# EAGLE design Keypad_Shield (EAGLE 6.4)
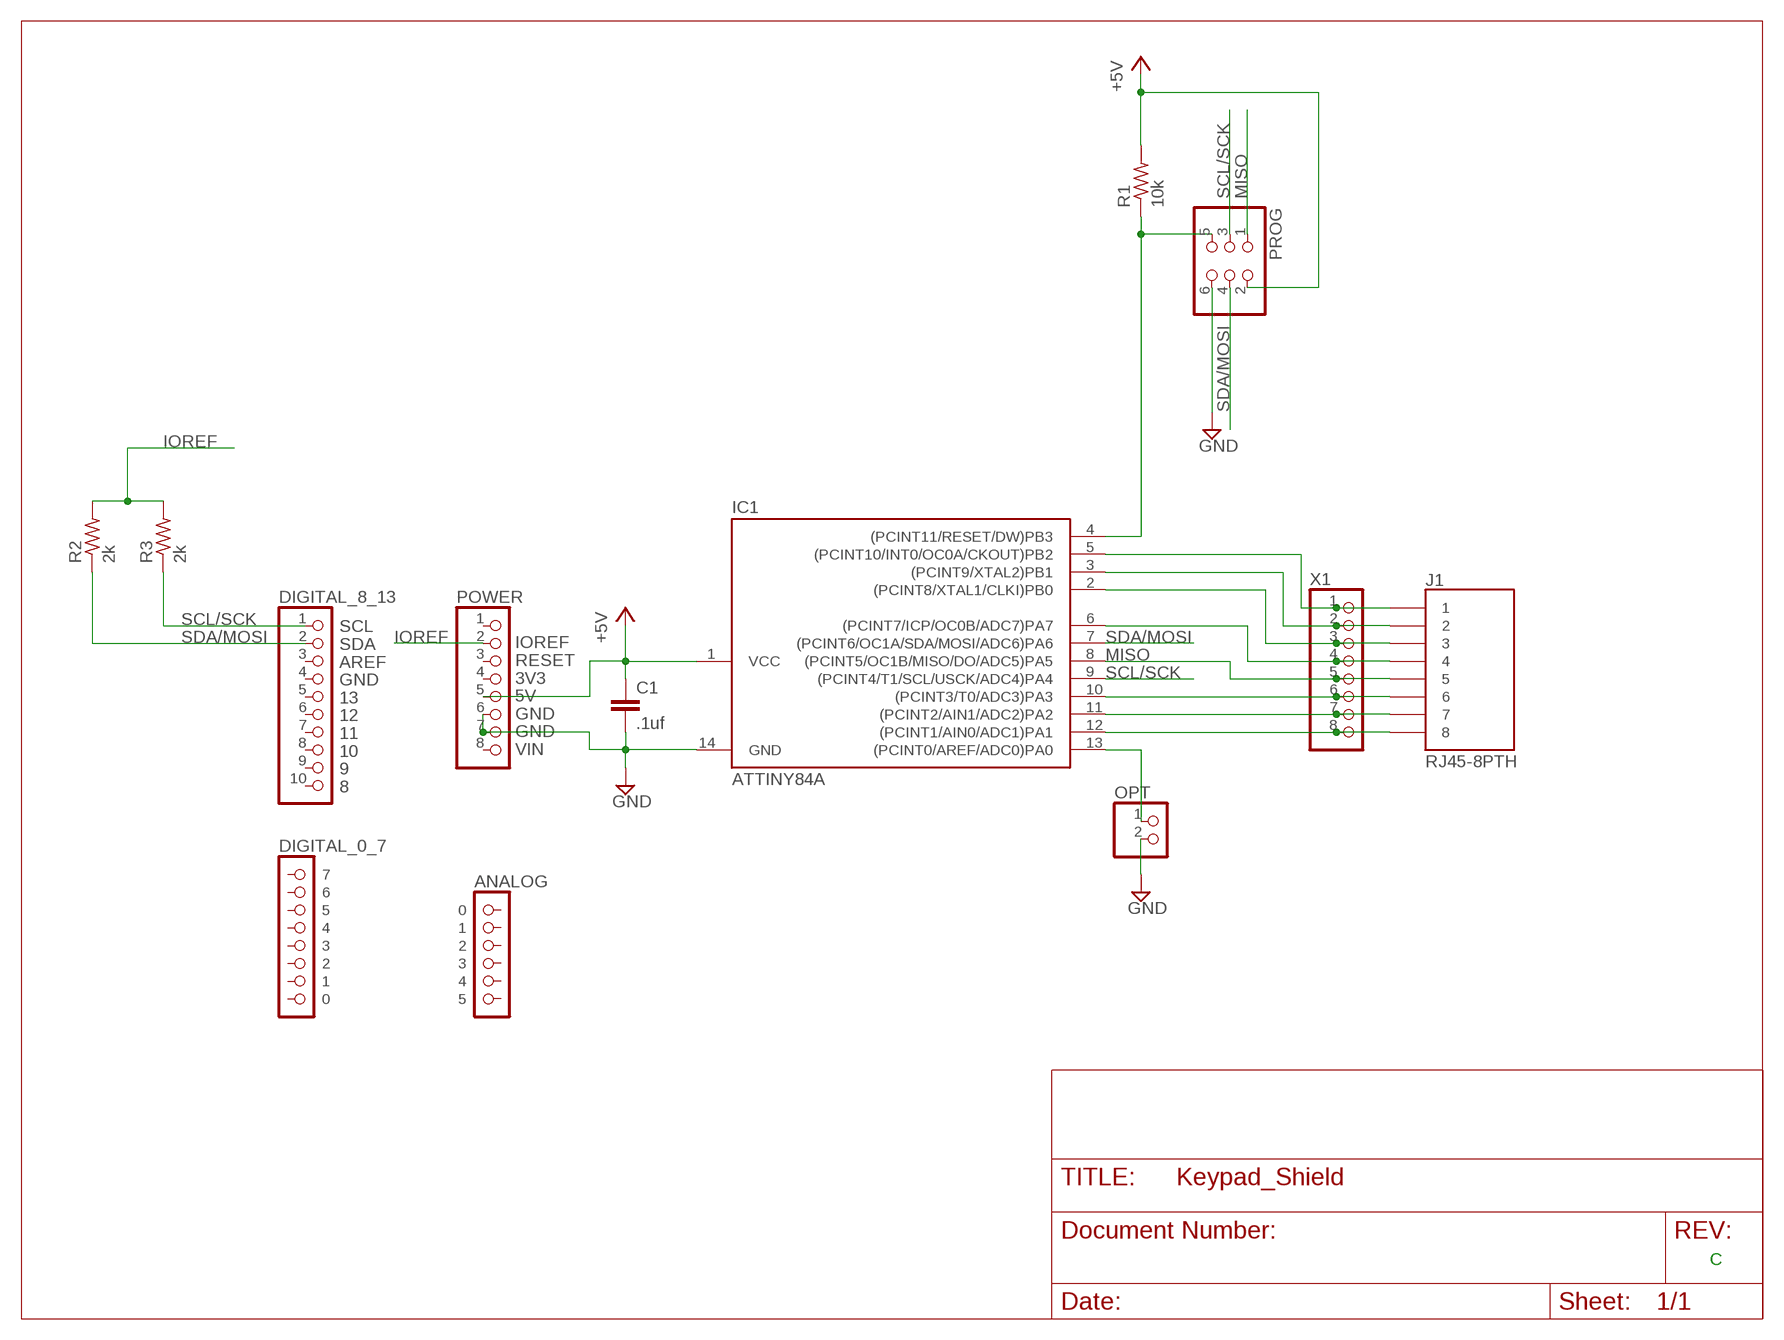
[diagram p0: schematic, sheet 1]

## Parts
C1  .1uf  C5/5  [C5B5]
DIGITAL_8_13  PINHD-1X10  [1X10]
IC1  ATTINY84A  TINY24/44/84-PU  [DIL14]
J1  RJ45-8PTH  [RJ45-8]
OPT  PINHD-1X2  [1X02]
POWER  PINHD-1X8  [1X08]
PROG  PINHD-2X3  [2X03]
R1  10k  R-US_0204/5  [0204/5]
R2  2k  R-US_0204/5  [0204/5]
R3  2k  R-US_0204/5  [0204/5]
U$2  ANALOG  [1X06]
U$3  DIGITAL_0_7  [1X08]
X1  HEADER-1X8ROUND  [1X08_ROUND]

## Nets
+5V: C1.1 IC1.1(VCC) POWER.5 PROG.2 R1.2
GND: C1.2 IC1.14(GND) OPT.2 POWER.6 POWER.7 PROG.6
IOREF: POWER.2 R2.2 R3.2
MISO: IC1.8((PCINT5/OC1B/MISO/DO/ADC5)PA5) J1.5 PROG.1 X1.5
N$1: IC1.4((PCINT11/RESET/DW)PB3) PROG.5 R1.1
N$2: IC1.13((PCINT0/AREF/ADC0)PA0) OPT.1
N$3: IC1.5((PCINT10/INT0/OC0A/CKOUT)PB2) J1.1 X1.1
N$4: IC1.3((PCINT9/XTAL2)PB1) J1.2 X1.2
N$5: IC1.2((PCINT8/XTAL1/CLKI)PB0) J1.3 X1.3
N$6: IC1.6((PCINT7/ICP/OC0B/ADC7)PA7) J1.4 X1.4
N$8: IC1.10((PCINT3/T0/ADC3)PA3) J1.6 X1.6
N$9: IC1.11((PCINT2/AIN1/ADC2)PA2) J1.7 X1.7
N$10: IC1.12((PCINT1/AIN0/ADC1)PA1) J1.8 X1.8
SCL/SCK: DIGITAL_8_13.1 IC1.9((PCINT4/T1/SCL/USCK/ADC4)PA4) PROG.3 R3.1
SDA/MOSI: DIGITAL_8_13.2 IC1.7((PCINT6/OC1A/SDA/MOSI/ADC6)PA6) PROG.4 R2.1
Unconnected: DIGITAL_8_13.3 DIGITAL_8_13.4 DIGITAL_8_13.5 DIGITAL_8_13.6 DIGITAL_8_13.7 DIGITAL_8_13.8 DIGITAL_8_13.9 DIGITAL_8_13.10 POWER.1 POWER.3 POWER.4 POWER.8 U$2.1 U$2.2 U$2.3 U$2.4 U$2.5 U$2.6 U$3.1 U$3.2 U$3.3 U$3.4 U$3.5 U$3.6 U$3.7 U$3.8

## Notes on the sheet
- IOREF
  RESET
  3V3
  5V
  GND
  GND
  VIN
- SCL
  SDA
  AREF
  GND
  13
  12
  11
  10
  9
  8
- C

## Library data of the parts
C1 = capacitor-wima:C: CAPACITOR naming: grid - package width
DIGITAL_8_13 = pinhead:PINHD-1X10: PIN HEADER
IC1 = avr-4:TINY24/44/84
J1 = SparkFun:RJ45-8: RJ45 Jack Simple RJ45, 8-pin connection - connector for common Cat5, Cat5e, and Cat6 Ethernet cables. Footprint not yet proven in production. Connector sku is PRT-00643; Breakout PCB sku is BOB-00716.
OPT = pinhead:PINHD-1X2: PIN HEADER
POWER = pinhead:PINHD-1X8: PIN HEADER
PROG = pinhead:PINHD-2X3: PIN HEADER
R1-R3 = rcl:R-US_: RESISTOR, American symbol
U$2 = arduino:ANALOG
U$3 = arduino:DIGITAL_0_7
X1 = microbuilder:HEADER-1X8: PIN HEADER

## Board
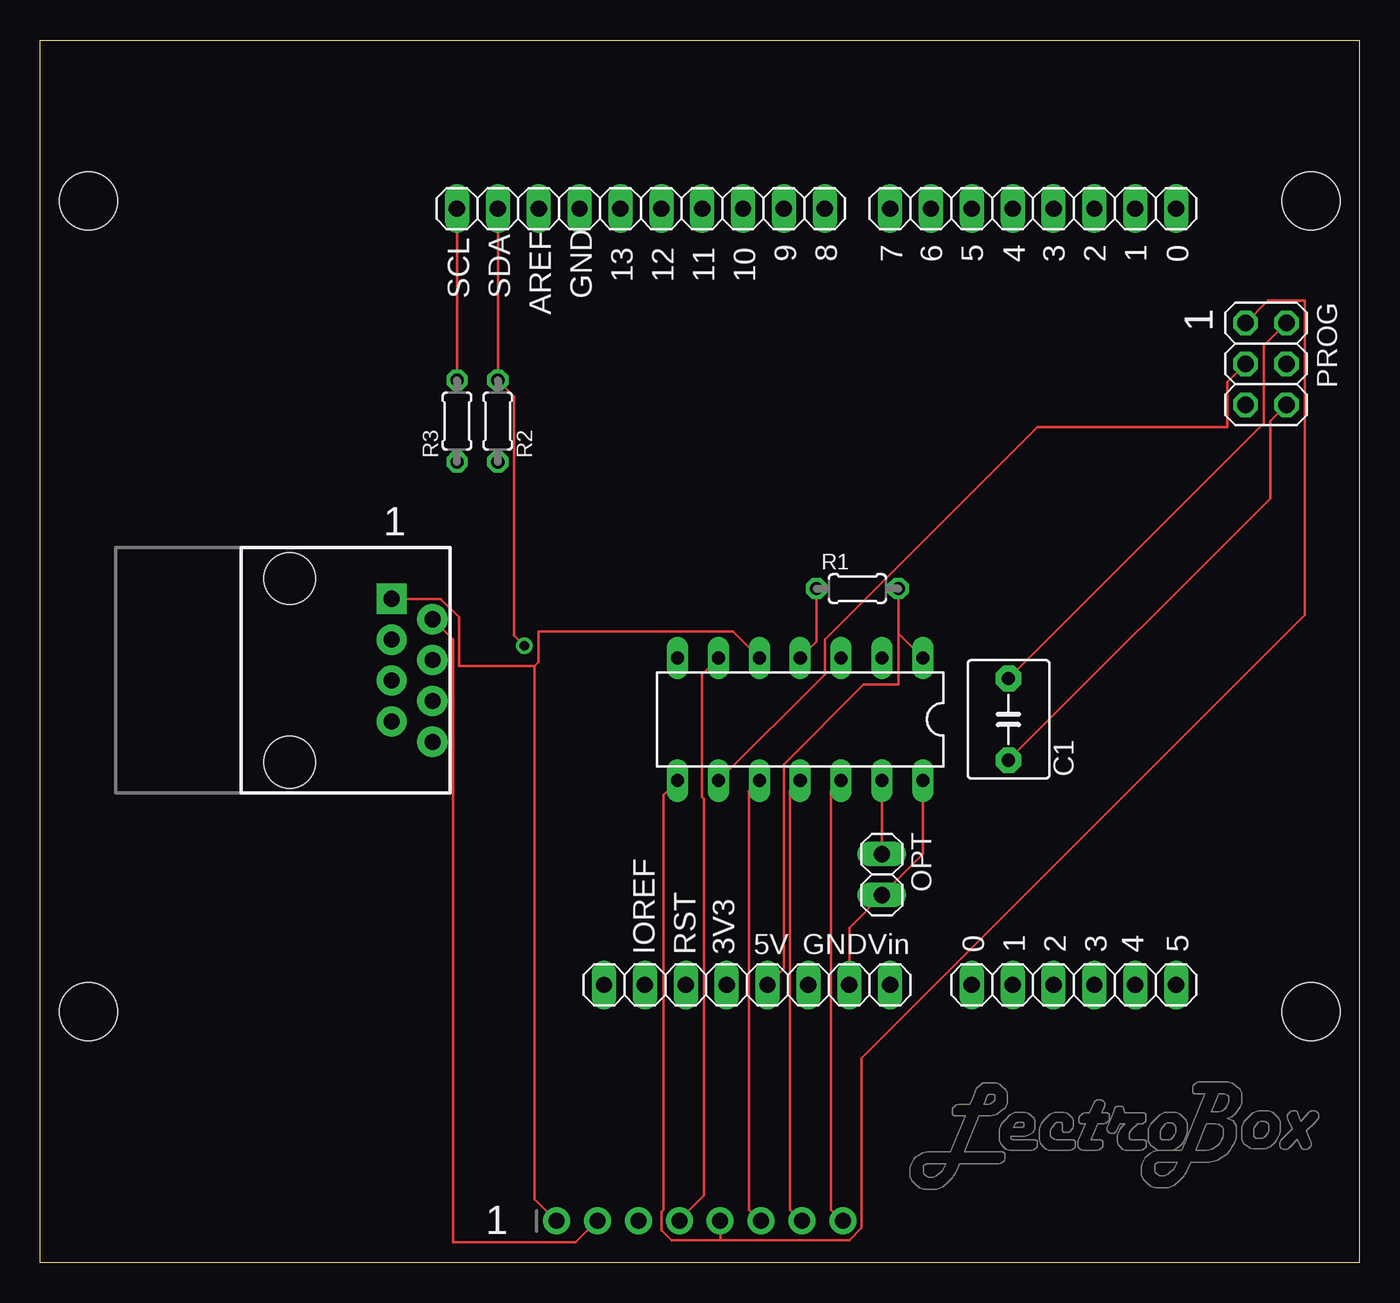
[diagram p1: board, top side]
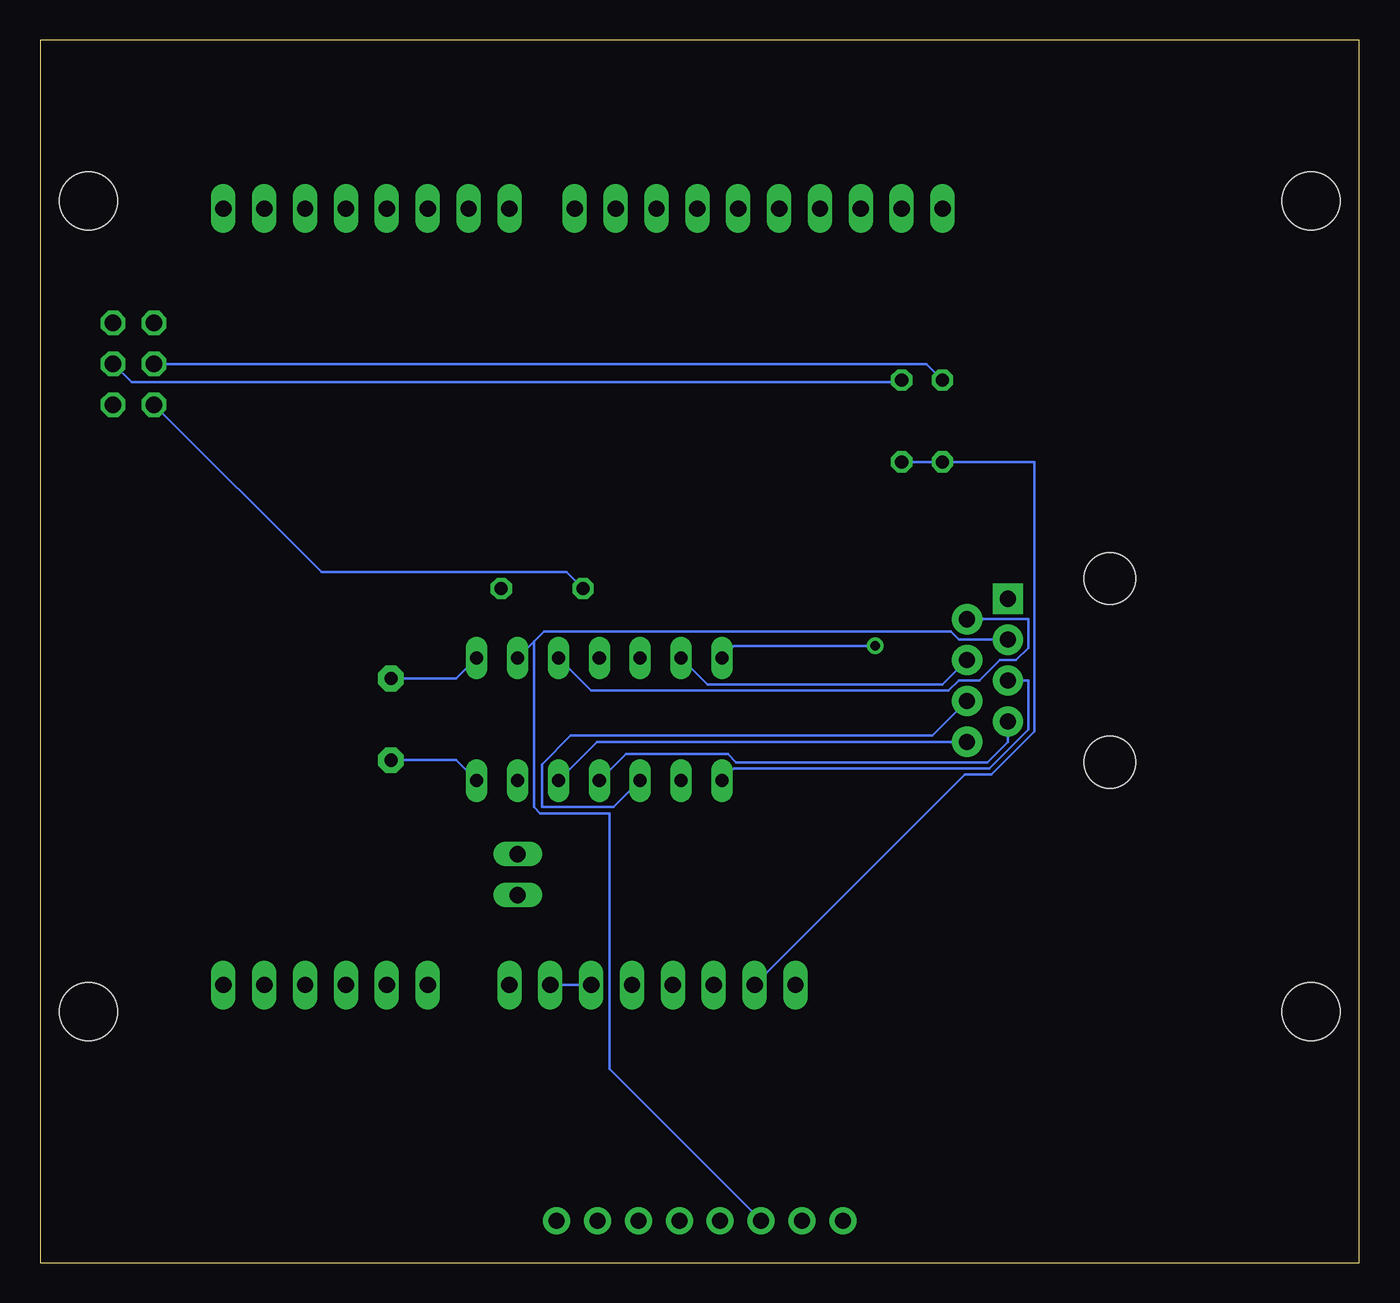
[diagram p2: board, bottom side, seen from below]

Size 82 x 76 mm. Coordinates in mm from the lower left corner, seen from the top.
Outline: 82,0 0,0 0,76 82,76 82,0
Copper layers (1*16): Top 0.035mm / dielectric 1.5mm / Bottom 0.035mm
Design rules "default *": minimum track width 6mil, minimum drill 24mil, track to track 8mil, track to pad 8mil, pad to pad 8mil, via to via 8mil, smd to smd 8mil, copper to edge 40mil, drill to drill 8mil, minimum pad ring 10mil, minimum via ring 8mil, stop-mask expansion 4mil, vias tented up to drill 0mil, thermal gap 10mil
Holes 3.6 mm at 3,66 79,66 3,15.6 79,15.6
tRestrict: area 32.8,52.1 to 68.6,55.9

### Footprints (pad centres in the part's own frame; a part is rotated, then mirrored left to right if it is on the bottom)
C5B5 = drill 0.813 pad 1.6 octagon: 1 -2.54,0; 2 2.54,0
1X10 = drill 1.016 long: 1 -11.43,0; 2 -8.89,0; 3 -6.35,0; 4 -3.81,0; 5 -1.27,0; 6 1.27,0; 7 3.81,0; 8 6.35,0; 9 8.89,0; 10 11.43,0
DIL14 = drill 0.813 long: 1 -7.62,-3.81; 2 -5.08,-3.81; 3 -2.54,-3.81; 4 0,-3.81; 5 2.54,-3.81; 6 5.08,-3.81; 7 7.62,-3.81; 8 7.62,3.81; 9 5.08,3.81; 10 2.54,3.81; 11 0,3.81; 12 -2.54,3.81; 13 -5.08,3.81; 14 -7.62,3.81
RJ45-8 = drill 1 pad 1.88 square: 1 -4.445,6.35 | drill 1 pad 1.88: 2 -3.175,8.89; 3 -1.905,6.35; 4 -0.635,8.89; 5 0.635,6.35; 6 1.905,8.89; 7 3.175,6.35; 8 4.445,8.89 | hole 3.2: -5.715,0; 5.715,0
1X02 = drill 1.016 long: 1 -1.27,0; 2 1.27,0
1X08 = drill 1.016 long: 1 -8.89,0; 2 -6.35,0; 3 -3.81,0; 4 -1.27,0; 5 1.27,0; 6 3.81,0; 7 6.35,0; 8 8.89,0
2X03 = drill 1.016 octagon: 1 -2.54,-1.27; 2 -2.54,1.27; 3 0,-1.27; 4 0,1.27; 5 2.54,-1.27; 6 2.54,1.27
0204/5 = drill 0.813 octagon: 1 -2.54,0; 2 2.54,0
1X06 = drill 1.016 long: 1 -6.35,0; 2 -3.81,0; 3 -1.27,0; 4 1.27,0; 5 3.81,0; 6 6.35,0
1X08_ROUND = drill 1 pad 1.676: 1 -8.89,0; 2 -6.35,0; 3 -3.81,0; 4 -1.27,0; 5 1.27,0; 6 3.81,0; 7 6.35,0; 8 8.89,0

### Placement (x,y rotation side)
C1  60.2,33.78 270 top
DIGITAL_8_13  37.34,65.53 0 top
IC1  47.24,33.78 180 top
J1  15.49,36.83 270 top
OPT  52.32,24.13 270 top
POWER  43.94,17.27 0 top
PROG  76.2,55.88 270 top
R1  50.8,41.91 0 top
R2  28.45,52.32 270 top
R3  25.91,52.32 270 top
U$2  64.26,17.27 0 top
U$3  61.72,65.53 0 top
X1  41,2.6 0 top

### Tracks (layer width: path | path; a pad name or v marks a point on that pad's centre or on a via)
+5V
  Top 0.152: 53.34,39.12 IC1.1 | R1.2 53.34,39.12 | POWER.5 46.23,18.29 46.23,30.99 51.18,35.94 53.34,35.94 53.34,39.12 | PROG.2 76.07,57.02 76.07,52.2 C1.1
  Bottom 0.152: IC1.1 56.13,36.32 C1.1
GND
  Top 0.152: POWER.7 50.29,20.83 OPT.2 54.86,25.4 IC1.14 | PROG.6 76.45,52.32 76.45,47.5 C1.2
  Bottom 0.152: POWER.7 POWER.6 | IC1.14 56.13,31.24 C1.2
IOREF
  Bottom 0.152: R2.2 R3.2 20.19,49.78 20.19,33.02 22.86,30.35 24.51,30.35 POWER.2
MISO
  Top 0.152: PROG.1 76.33,59.82 78.61,59.82 78.61,40.26 51.05,12.7 51.05,2.16 50.29,1.4 42.29,1.4 | 42.29,1.4 42.29,2.54 X1.5 | IC1.8 38.73,29.08 38.73,3.3 38.61,3.17 38.61,2.03 39.24,1.4 42.29,1.4
  Bottom 0.152: IC1.8 38.86,30.73 22.99,30.73 20.57,33.15 20.57,36.2 J1.5
N$1
  Top 0.152: IC1.4 48.26,38.61 R1.1
  Bottom 0.152: PROG.5 64.52,42.93 49.28,42.93 R1.1
N$2
  Top 0.152: OPT.1 IC1.13
N$3
  Top 0.152: IC1.5 43.05,39.24 30.99,39.24 30.99,37.34 30.73,37.08 | 30.73,37.08 26.04,37.08 26.04,40.13 24.89,41.27 J1.1 | 30.73,37.08 30.73,3.94 32,2.67 X1.1
N$4
  Top 0.152: J1.2 25.65,38.73 25.65,1.27 33.27,1.27 34.54,2.54 X1.2
  Bottom 0.152: IC1.3 47.75,35.56 25.53,35.56 24.89,36.2 23.62,36.2 22.35,37.47 21.34,37.47 20.57,38.23 20.57,40.01 J1.2
N$5
  Bottom 0.152: 51.31,38.61 50.67,39.24 25.4,39.24 24.89,38.73 J1.3 | 51.31,38.61 IC1.2 | 51.31,38.61 51.31,28.32 50.93,27.94 46.61,27.94 46.61,12.06 37.21,2.67 X1.3
N$6
  Top 0.152: IC1.6 41.15,36.58 41.15,28.96 41.27,28.83 41.27,4.19 39.75,2.67 X1.4
  Bottom 0.152: IC1.6 40.51,35.94 25.91,35.94 J1.4
N$8
  Top 0.152: IC1.10 44.07,29.34 44.07,3.3 44.7,2.67 X1.6
  Bottom 0.152: J1.6 26.54,32.77 49.02,32.77 50.8,30.99 50.8,28.32 46.35,28.32 IC1.10
N$9
  Top 0.152: IC1.11 46.61,29.34 46.61,3.3 47.24,2.67 X1.7
  Bottom 0.152: J1.7 21.84,32.38 23.11,31.11 38.73,31.11 39.24,31.62 45.59,31.62 IC1.11
N$10
  Top 0.152: IC1.12 49.15,29.34 49.15,3.3 49.78,2.67 X1.8
  Bottom 0.152: IC1.12 47.37,32.38 J1.8
SCL/SCK
  Top 0.152: DIGITAL_8_13.1 R3.1 | IC1.9 48.77,36.58 48.77,38.73 61.98,51.94 73.79,51.94 73.79,54.74 PROG.3
  Bottom 0.152: R3.1 26.92,55.88 PROG.3
SDA/MOSI  (via drill 0.61)
  Top 0.152: v30.1,38.35 29.46,38.99 29.46,53.85 R2.1 DIGITAL_8_13.2
  Bottom 0.152: IC1.7 38.86,38.35 v30.1,38.35 | PROG.4 76.33,54.74 28.57,54.74 R2.1

### Text on the board
tNames: 9 | 8 | 7 | 6 | 5 | 4 | 3 | 2 | 1 | 0 | 13 | 12 | 11 | 10 | SCL | SDA | GND | AREF | 1 | 1 | IOREF | RST | 3V3 | 5V | GND | Vin | 0 | 1 | 2 | 3 | 4 | 5 | 1
tDocu: Default 7-bit TWI address is 0x32 / With OPT closed, address is 0x75 | LectroBox Matrix Keypad Shield / Rev C Feb 2017 CC BY-SA 4.0
TallParts: USB | ISP | PWR
ArduinoHoles: 3.2mm | 2.2mm | 3.2mm